# EAGLE design esp12Stack (EAGLE 7.7.0)
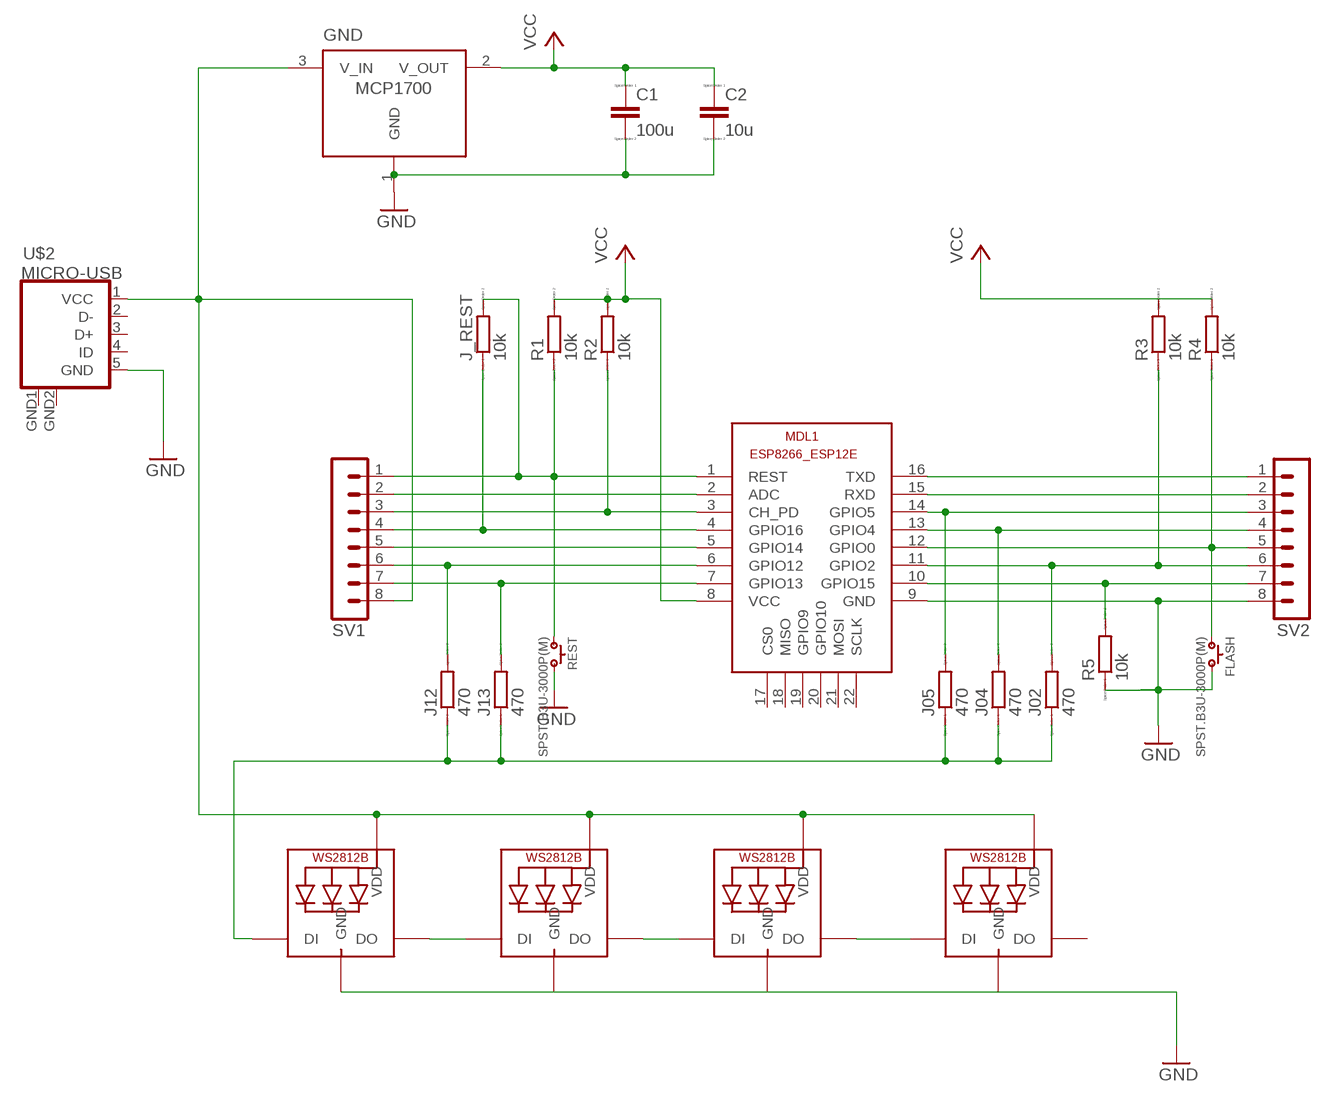
[diagram p0: schematic, sheet 1]

## Parts
C1  100u  C  [C0805]
C2  10u  C  [C0805]
FLASH  SPST.B3U-3000P(M)  [B3U-3000P(M)]
GND  MCP1700SOT23  [SOT-23]
J02  470  R  [R0805]
J04  470  R  [R0805]
J05  470  R  [R0805]
J12  470  R  [R0805]
J13  470  R  [R0805]
J_REST  10k  R  [R0805]
LED1  WS2812B5050  [WS2812B]
LED2  WS2812B5050  [WS2812B]
LED3  WS2812B5050  [WS2812B]
LED4  WS2812B5050  [WS2812B]
MDL1  ESP8266-12EESP8266-ESP12E  [ESP8266-ESP12E]
R1  10k  R  [R0805]
R2  10k  R  [R0805]
R3  10k  R  [R0805]
R4  10k  R  [R0805]
R5  10k  R  [R0805]
REST  SPST.B3U-3000P(M)  [B3U-3000P(M)]
SV1  MA08-1  [MA08-1]
SV2  MA08-1  [MA08-1]
U$2  MICRO-USB  [MICRO-USB]

## Nets
3V3: C1.1 C2.1 GND.2(V_OUT) MDL1.8(VCC) R1.2 R2.2 R3.2 R4.2 ; supply symbol labelled VCC
5V: GND.3(V_IN) LED1.1-VDD(VDD) LED2.1-VDD(VDD) LED3.1-VDD(VDD) LED4.1-VDD(VDD) SV1.8 U$2.1(VCC)
ADC: MDL1.2(ADC) SV1.2
CH_PD: MDL1.3(CH_PD) R2.1 SV1.3
DIN: J02.1 J04.1 J05.1 J12.1 J13.1 LED1.4-DIN(DI)
DOUT1DIN2: LED1.2-DOUT(DO) LED2.4-DIN(DI)
DOUT2DIN3: LED2.2-DOUT(DO) LED3.4-DIN(DI)
DOUT3DIN4: LED3.2-DOUT(DO) LED4.4-DIN(DI)
GND: C1.2 C2.2 FLASH.2 GND.1(GND) LED1.3-GND(GND) LED2.3-GND(GND) LED3.3-GND(GND) LED4.3-GND(GND) MDL1.9(GND) R5.1 REST.2 SV2.8 U$2.5(GND)
GPIO0: FLASH.1 MDL1.12(GPIO0) R4.1 SV2.5
GPIO2: J02.2 MDL1.11(GPIO2) R3.1 SV2.6
GPIO4: J04.2 MDL1.13(GPIO4) SV2.4
GPIO5: J05.2 MDL1.14(GPIO5) SV2.3
GPIO12: J12.2 MDL1.6(GPIO12) SV1.6
GPIO13: J13.2 MDL1.7(GPIO13) SV1.7
GPIO14: MDL1.5(GPIO14) SV1.5
GPIO15: MDL1.10(GPIO15) R5.2 SV2.7
GPIO16: J_REST.1 MDL1.4(GPIO16) SV1.4
REST: J_REST.2 MDL1.1(REST) R1.1 REST.1 SV1.1
RXD: MDL1.15(RXD) SV2.2
TXD: MDL1.16(TXD) SV2.1
Unconnected: LED4.2-DOUT(DO) MDL1.17(CS0) MDL1.18(MISO) MDL1.19(GPIO9) MDL1.20(GPIO10) MDL1.21(MOSI) MDL1.22(SCLK) U$2.2(D-) U$2.3(D+) U$2.4(ID)

## Power pins joined to a net without a drawn wire
GND: U$2.GND1(GND) U$2.GND2(GND)

## Library data of the parts
C1 C2 = eagle-ltspice:C: CAPACITOR, European symbol; SPICEMODEL: NONE; SPICEPREFIX: C
FLASH REST = omron:SPST
GND = MCP1700:MCP1700SOT23
J02 J04 J05 J12 J13 J_REST R1-R5 = eagle-ltspice:R: RESISTOR, European symbol; SPICEMODEL: NONE; SPICEPREFIX: R
LED1-LED4 = adafruit:WS2812B
MDL1 = ESP12E:ESP8266-12E: ESP8266-12E with additional I/O and GPIO04/05 corrected The author cannot warrant that this library is free from error or will meet your specific requirements. Created by PuceBaboon.com. Komagane, Nagano, JAPAN
SV1 SV2 = con-lstb:MA08-1: PIN HEADER; OC_FARNELL: unknown; OC_NEWARK: unknown
U$2 = microusb (1):MICRO-USB: Micro USB B connector

## Board
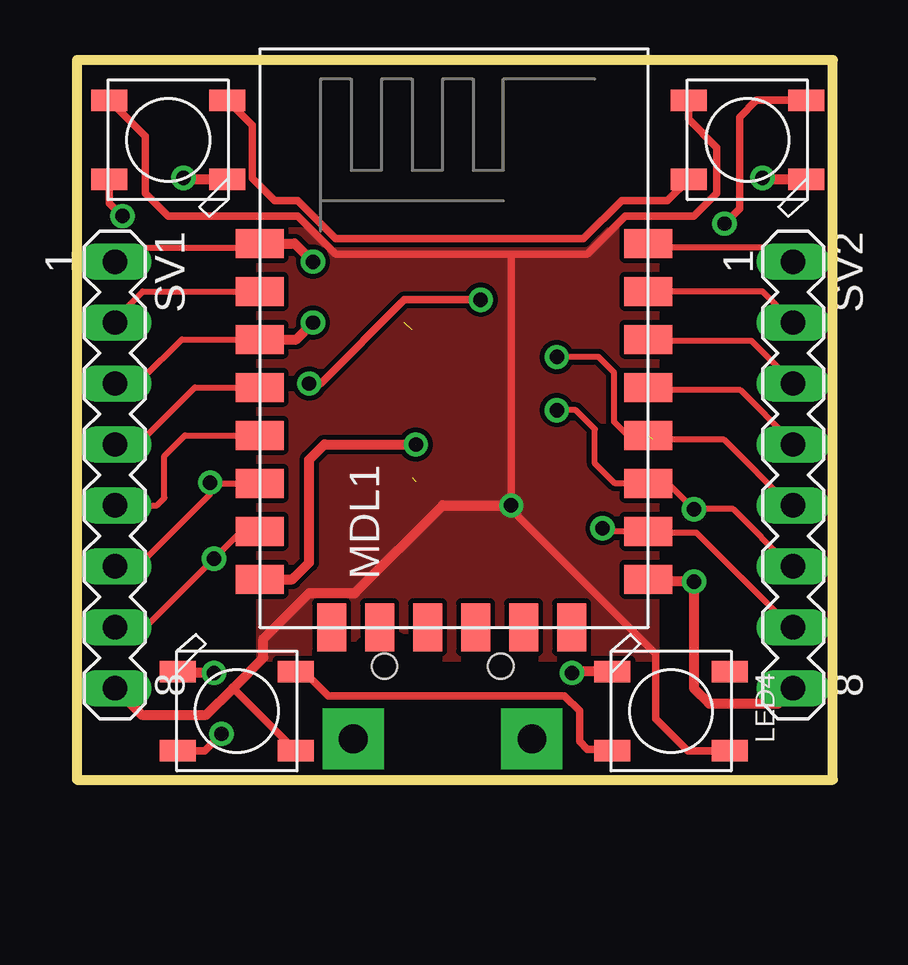
[diagram p1: board, top side]
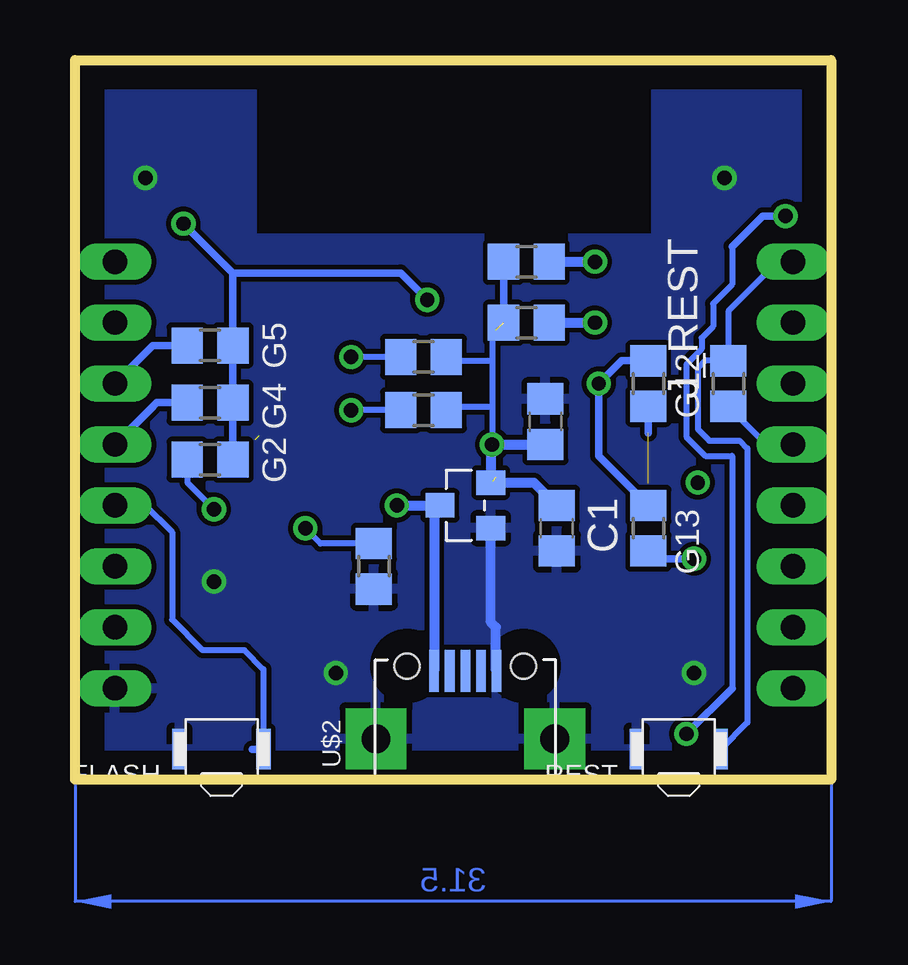
[diagram p2: board, bottom side, seen from below]

Size 31.5 x 30 mm. Coordinates in mm from the lower left corner, seen from the top.
Outline: 0,0 31.5,0 31.5,30 0,30 0,0
Copper layers (1*16): Top 0.035mm / dielectric 1.5mm / Bottom 0.035mm
Design rules "default": minimum track width 10mil, minimum drill 24mil, track to track 8mil, track to pad 8mil, pad to pad 8mil, via to via 8mil, smd to smd 8mil, copper to edge 40mil, drill to drill 8mil, minimum pad ring 10mil, minimum via ring 8mil, stop-mask expansion 4mil, vias tented up to drill 0mil, thermal gap 10mil

### Footprints (pad centres in the part's own frame; a part is rotated, then mirrored left to right if it is on the bottom)
C0805 = smd 1.3 x 1.5: 1 -0.95,0; 2 0.95,0
B3U-3000P(M) = smd 0.6 x 1.7: 1 -1.75,0; 2 1.75,0
SOT-23 = smd 1.016 x 1.2: 1 -0.95,-1.06; 2 0.95,-1.06; 3 0,1.06
R0805 = smd 1.3 x 1.5: 1 -0.95,0; 2 0.95,0
WS2812B = smd 1.5 x 0.9: 1-VDD 2.45,-1.65; 2-DOUT 2.45,1.65; 3-GND -2.45,1.65; 4-DIN -2.45,-1.65
ESP8266-ESP12E = smd 2 x 1.2: 1 0,16; 2 0,14; 3 0,12; 4 0,10; 5 0,8; 6 0,6; 7 0,4; 8 0,2; 9 16.2,2; 10 16.2,4; 11 16.2,6; 12 16.2,8; 13 16.2,10; 14 16.2,12; 15 16.2,14; 16 16.2,16 | smd 1.2 x 2: 17 11,0; 18 3,0; 19 5,0; 20 13,0; 21 7,0; 22 9,0
MA08-1 = drill 1.016 long: 1 -8.89,0; 2 -6.35,0; 3 -3.81,0; 4 -1.27,0; 5 1.27,0; 6 3.81,0; 7 6.35,0; 8 8.89,0
MICRO-USB = smd 0.4 x 1.75: 1 -1.3,4.525; 2 -0.65,4.525; 3 0,4.525; 4 0.65,4.525; 5 1.3,4.525 | drill 1.2 pad 2.54 square: GND1 -3.725,1.7; GND2 3.725,1.7 | hole 1.05: -2.425,4.73; 2.425,4.73

### Placement (x,y rotation side)
C1  11.43,10.48 270 bottom
C2  11.91,14.92 90 bottom
FLASH  25.4,1.27 180 bottom
GND  15.24,11.43 90 bottom
J02  25.88,13.34 180 bottom
J04  25.88,15.72 180 bottom
J05  25.88,18.1 180 bottom
J12  7.62,16.51 270 bottom
J13  7.62,10.48 270 bottom
J_REST  4.29,16.51 90 bottom
LED1  27.94,26.67 180 top
LED2  3.81,26.67 180 top
LED3  6.67,2.86 0 top
LED4  24.77,2.86 0 top
MDL1  7.62,6.35 0 top
R1  12.7,21.59 180 bottom
R2  12.7,19.05 180 bottom
R3  16.99,15.4 0 bottom
R4  16.99,17.62 0 bottom
R5  19.05,8.89 90 bottom
REST  6.35,1.27 180 bottom
SV1  1.59,12.7 270 top
SV2  29.84,12.7 270 top
U$2  15.24,0 0 bottom

### Tracks (layer width: path | path; a pad name or v marks a point on that pad's centre or on a via)
3V3  (via drill 0.6)  (3 unrouted)
  Top 0.406: MDL1.8 8.98,8.35 9.68,9.05 9.68,13.34 10.32,13.97 v14.13,13.97
  Bottom 0.254: GND.2 14.13,12.43 | 13.97,18.73 14.13,18.57 14.13,17.46 | 14.13,17.46 14.13,15.56 | 14.13,15.56 v14.13,13.97 | 15.88,17.46 14.13,17.46 | R3.2 15.88,15.56 14.13,15.56
  Bottom 0.305: R2.2 R1.2 | 15.88,17.46 R4.2
  Bottom 0.406: C1.1 12.38,12.38 GND.2 14.18,13.92 v14.13,13.97 C2.1 | 13.97,12.59 13.86,12.59
5V  (via drill 0.6)
  Top 0.305: LED1.1-VDD 25.49,27.53 26.67,26.35 26.67,24.45 25.72,23.5 22.86,23.5 21.27,21.91 18.1,21.91 | LED2.1-VDD 2.86,26.82 2.86,24.45 3.81,23.5 9.21,23.5 10.79,21.91 18.1,21.91 | LED4.1-VDD 25.46,1.21 24.13,2.54 24.13,5.24 18.41,10.95 v18.1,11.43 | LED3.1-VDD 6.51,3.81 | 18.1,12.7 v18.1,11.43 | 18.1,21.91 v18.1,11.43
  Top 0.406: v18.1,11.43 15.24,11.43 11.59,7.78 9.68,7.78 7.78,5.87 7.78,5.07 6.51,3.81 5.4,2.7 2.7,2.7 SV1.8
  Bottom 0.406: U$2.1 16.54,11.19 GND.3 v18.1,11.43
  pour Top: 7.62,22.86 24.13,22.86 24.13,5.08 7.62,5.08
ADC
  Top 0.254: MDL1.2 7.54,20.34 2.74,20.34 1.6,19.2 SV1.2
CH_PD  (via drill 0.6)
  Top 0.254: 7.54,18.29 MDL1.3 4.38,18.35 2.72,16.69 1.6,16.69 SV1.3
  Top 0.406: MDL1.3 9.14,18.35 v9.84,19.05
  Bottom 0.406: R2.1 v9.84,19.05
DIN  (via drill 0.6)
  Top 0.305: LED1.4-DIN 28.32,28.32 27.62,27.62 27.62,23.81 v26.99,23.18 | v16.83,20 13.65,20 10.16,16.51 v9.68,16.51
  Bottom 0.305: 26.67,22.86 v26.99,23.18 24.93,21.12 | J13.1 9.68,13.49 v9.68,16.51 8.73,17.46 J12.1 | J02.1 J04.1 J05.1 24.93,21.12 | 24.93,21.12 17.94,21.12 v16.83,20
DOUT1DIN2
  Top 0.305: LED2.4-DIN 7.3,27.28 7.3,25.08 8.26,24.13 9.21,24.13 10.79,22.54 21.11,22.54 22.7,24.13 24.6,24.13 LED1.2-DOUT
DOUT2DIN3  (via drill 0.6)
  Top 0.305: LED2.2-DOUT 1.36,24.04 v1.91,23.5 | LED3.4-DIN 5.33,1.21 v6.03,1.91
  Bottom 0.254: 4.13,22.23 4.13,20.64 4.92,19.84 4.92,18.89 5.4,18.41 5.4,17.94 6.03,17.3 6.03,14.29 5.24,13.49 4.13,13.49 4.13,3.81
  Bottom 0.305: v1.91,23.5 2.86,23.5 4.13,22.23 | 4.13,3.81 v6.03,1.91
DOUT3DIN4
  Top 0.305: LED3.2-DOUT 9.46,4.51 10.48,3.49 20.32,3.49 20.95,2.86 20.95,1.59 21.27,1.27 22.25,1.27 LED4.4-DIN
GND  (via drill 0.6)
  Top 0.406: v5.71,4.45 4.28,4.45 LED3.3-GND | LED4.3-GND 20.7,4.51 v20.64,4.45 | LED1.3-GND 28.64,25.02 v28.57,25.08 | LED2.3-GND 4.51,25.02 v4.45,25.08 | SV2.8 29.21,3.17 26.35,3.17 25.72,3.81 v25.72,8.26 23.91,8.26 MDL1.9
  Bottom 0.406: U$2.5 13.97,4.55 13.97,6.35 14.18,6.56 GND.1
  pour Bottom: 0,0 0,30.16 7.3,30.16 7.3,22.54 24.13,22.54 24.13,30.16 31.43,30.16 31.43,0
GPIO0  (via drill 0.6)  (1 unrouted)
  Top 0.254: SV2.5 v29.72,11.43 26.98,14.17 24.29,14.17 24,14.17 23.13,14.17 22.38,14.92 22.38,16.99 21.75,17.62 v20,17.62
  Bottom 0.254: v29.72,11.43 28.57,11.43 27.46,10.32 27.46,6.67 26.19,5.4 24.45,5.4 23.65,4.6 FLASH.1 | R4.1 v20,17.62
  Bottom 0.305: FLASH.1 24.13,1.27
GPIO2  (via drill 0.6)
  Top 0.254: SV2.6 29.72,8.91 27.36,11.27 v25.72,11.27 24.64,12.35 MDL1.11 22.42,12.35 21.59,13.18 21.59,14.61 20.8,15.4 v20,15.4
  Bottom 0.254: J02.2 26.83,12.38 v25.72,11.27 | R3.1 v20,15.4
GPIO4
  Top 0.254: MDL1.13 24,16.23 27.66,16.23 29.72,14.17 SV2.4
  Bottom 0.305: 28.25,15.56 SV2.4 28.1,15.72 J04.2
GPIO5
  Top 0.254: MDL1.14 24,18.29 28.12,18.29 29.72,16.69 SV2.3
  Bottom 0.305: J05.2 28.26,18.1 SV2.3
GPIO12  (via drill 0.6)  (1 unrouted)
  Top 0.254: 7.54,12.34 MDL1.6 5.59,12.35 v5.56,12.38 5.56,11.91 2.54,8.89 SV1.6 1.6,8.91
  Bottom 0.305: J12.2 7.62,14.45
GPIO13  (via drill 0.6)
  Top 0.254: SV1.7 1.6,6.4 2.91,6.4 v5.71,9.21 6.86,10.35 MDL1.7
  Top 0.406: MDL1.7 7.62,10.16
  Bottom 0.305: J13.2 7.3,9.21 v5.71,9.21
GPIO14
  Top 0.254: 7.54,14.17 MDL1.5 4.51,14.35 3.65,13.49 3.65,11.75 3.33,11.43 SV1.5
GPIO15  (via drill 0.6)
  Top 0.254: SV2.7 29.72,6.4 25.83,10.29 24,10.29 MDL1.10 22.04,10.35 v21.91,10.48
  Bottom 0.254: R5.2 21.27,9.84 v21.91,10.48
GPIO16
  Top 0.254: 7.54,16.23 MDL1.4 4.92,16.35 2.74,14.17 1.6,14.17 SV1.4
  Bottom 0.254: SV1.4 2.7,13.97 J_REST.1
REST  (via drill 0.6)
  Top 0.254: MDL1.1 7.54,22.17 2.06,22.17 1.6,21.72 SV1.1
  Top 0.406: MDL1.1 9.08,22.35 v9.84,21.59
  Bottom 0.254: SV1.1 2.22,21.59 4.29,19.53 J_REST.2 5.24,17.46 5.56,17.14 5.56,14.61 5.08,14.13 3.81,14.13 3.49,13.81 3.49,2.38 REST.1
  Bottom 0.406: R1.1 v9.84,21.59
RXD
  Top 0.254: MDL1.15 24,20.34 28.57,20.34 29.72,19.2 SV2.2
TXD
  Top 0.254: SV2.1 29.26,22.17 24,22.17 MDL1.16
(copper drawn outside any net)
  shapes: Bottom area x1

### Text on the board
bNames: G12 | G5 | G4 | G2 | G13